# EAGLE design Scriptable Guitar Pedal (EAGLE 8.6.1)
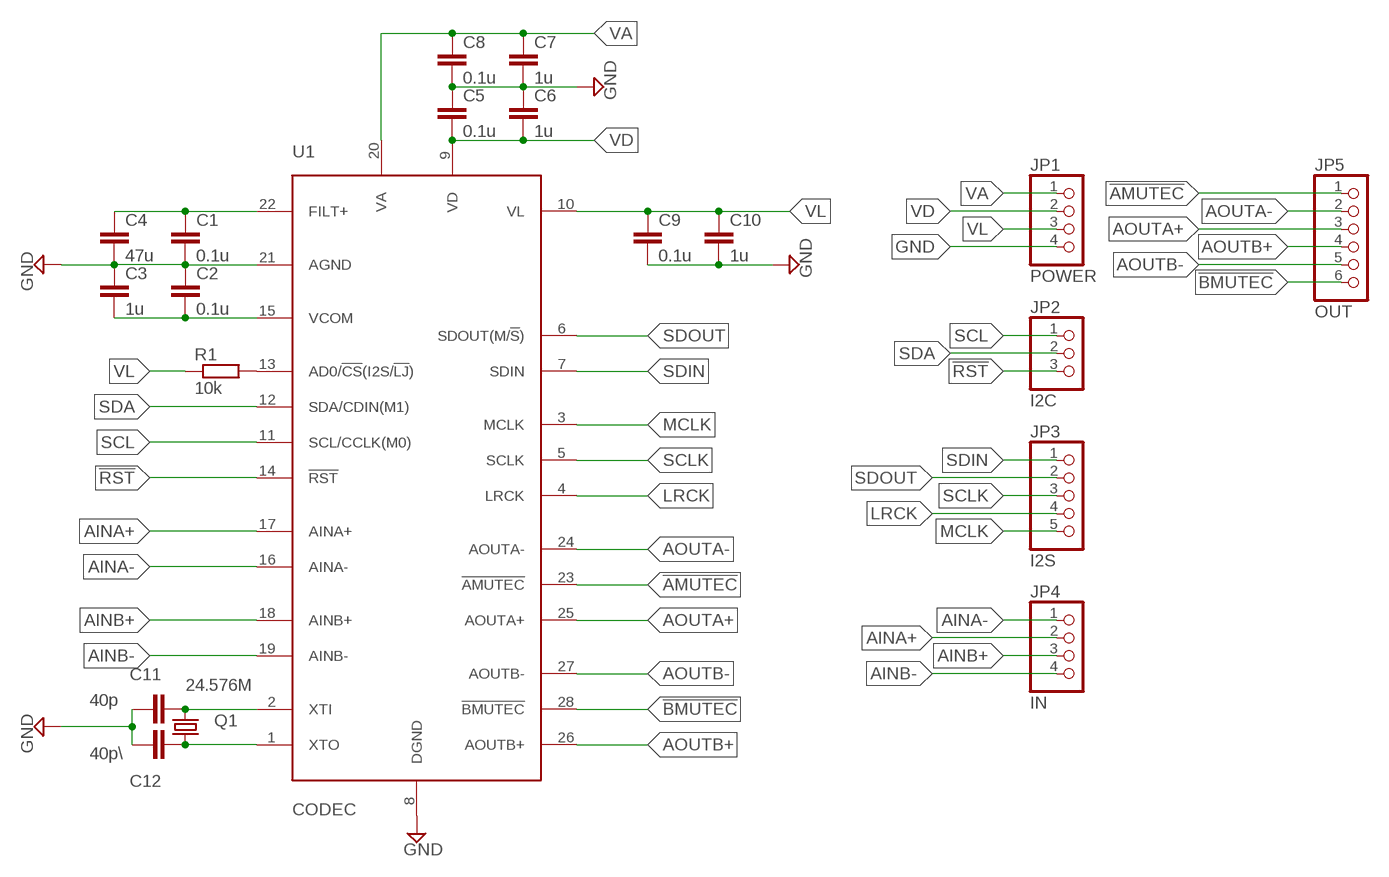
[diagram p0: schematic, sheet 1]

## Parts
C1  0.1u  C-EUC0603  [C0603]
C2  0.1u  C-EUC0603  [C0603]
C3  1u  C-EUC0603  [C0603]
C4  47u  C-EUC0603  [C0603]
C5  0.1u  C-EUC0603  [C0603]
C6  1u  C-EUC0603  [C0603]
C7  1u  C-EUC0603  [C0603]
C8  0.1u  C-EUC0603  [C0603]
C9  0.1u  C-EUC0603  [C0603]
C10  1u  C-EUC0603  [C0603]
C11  40p  C-EUC0603  [C0603]
C12  40p\  C-EUC0603  [C0603]
JP1  POWER  PINHD-1X4  [1X04]
JP2  I2C  PINHD-1X3  [1X03]
JP3  I2S  PINHD-1X5  [1X05]
JP4  IN  PINHD-1X4  [1X04]
JP5  OUT  PINHD-1X6  [1X06]
Q1  24.576M  CRYSTALHC49U-V  [HC49U-V]
R1  10k  R-EU_R0603  [R0603]
U1  CODEC  CS4272  [TSSOP-28]

## Nets
!AMUTEC!: JP5.1 U1.23(!AMUTEC!)
!BMUTEC!: JP5.6 U1.28(!BMUTEC!)
!RST!: JP2.3 U1.14(!RST!)
AINA+: JP4.2 U1.17(AINA+)
AINA-: JP4.1 U1.16(AINA-)
AINB+: JP4.3 U1.18(AINB+)
AINB-: JP4.4 U1.19(AINB-)
AOUTA+: JP5.3 U1.25(AOUTA+)
AOUTA-: JP5.2 U1.24(AOUTA-)
AOUTB+: JP5.4 U1.26(AOUTB+)
AOUTB-: JP5.5 U1.27(AOUTB-)
FILT+: C1.1 C4.1 U1.22(FILT+)
GND: C1.2 C2.1 C3.1 C4.2 C5.1 C6.1 C7.2 C8.2 C9.2 C10.2 C11.1 C12.1 JP1.4 U1.8(DGND) U1.21(AGND)
LRCK: JP3.4 U1.4(LRCK)
MCLK: JP3.5 U1.3(MCLK)
N$1: C12.2 Q1.1 U1.1(XTO)
N$2: C11.2 Q1.2 U1.2(XTI)
N$5: R1.2 U1.13(AD0/!CS!(I2S/!LJ!))
SCL: JP2.1 U1.11(SCL/CCLK(M0))
SCLK: JP3.3 U1.5(SCLK)
SDA: JP2.2 U1.12(SDA/CDIN(M1))
SDIN: JP3.1 U1.7(SDIN)
SDOUT: JP3.2 U1.6(SDOUT(M/!S!))
VA: C7.1 C8.1 JP1.1 U1.20(VA)
VCOM: C2.2 C3.2 U1.15(VCOM)
VD: C5.2 C6.2 JP1.2 U1.9(VD)
VL: C9.1 C10.1 JP1.3 R1.1 U1.10(VL)

## Library data of the parts
C1-C12 = rcl:C-EU: CAPACITOR, European symbol; SPICEPREFIX: C
JP1 JP4 = pinhead:PINHD-1X4: PIN HEADER
JP2 = pinhead:PINHD-1X3: PIN HEADER
JP3 = pinhead:PINHD-1X5: PIN HEADER
JP5 = pinhead:PINHD-1X6: PIN HEADER
Q1 = crystal:CRYSTAL: CRYSTAL; OC_FARNELL: 1666969; OC_NEWARK: unknown
R1 = rcl:R-EU_: RESISTOR, European symbol; SPICEPREFIX: R
U1 = CS4272:CS4272: 24-bit, 192 kHz Stereo Audio CODEC D/A Features High Performance 114 dB Dynamic Range -100 dB THD+N Up to 192 kHz Sampling Rates Differential Analog Architecture Volume Control with Soft Ramp 1 dB Step Size Zero Crossing Click-free Transitions Selectable Digital Filters Fast and Slow Roll Off ATAPI Mixing Functions Selectable Serial Audio Interface Formats Left Justified up to 24-bit I2S up to 24-bit Right Justified 16-, 18-, 20-, and 24-bit Control Output for External Muting Selectable 50/15 us De-emphasis A/D Features High Performance 114 dB Dynamic Range -100 dB THD+N Up to 192 kHz Sampling Rates Differential Analog Architecture Multi-bit Delta Sigma Conversion High-pass Filter or DC Offset Calibration Low-Latency Digital Anti-alias Filtering Automatic Dithering of 16-bit Data Selectable Serial Audio Interface Formats Left Justified up to 24-bit I2S up to 24-bit System Features Direct Interface with 5V to 2.5V Logic Levels Internal Digital Loopback On-chip Oscillator Stand-Alone or Control Port Functionality

## Board
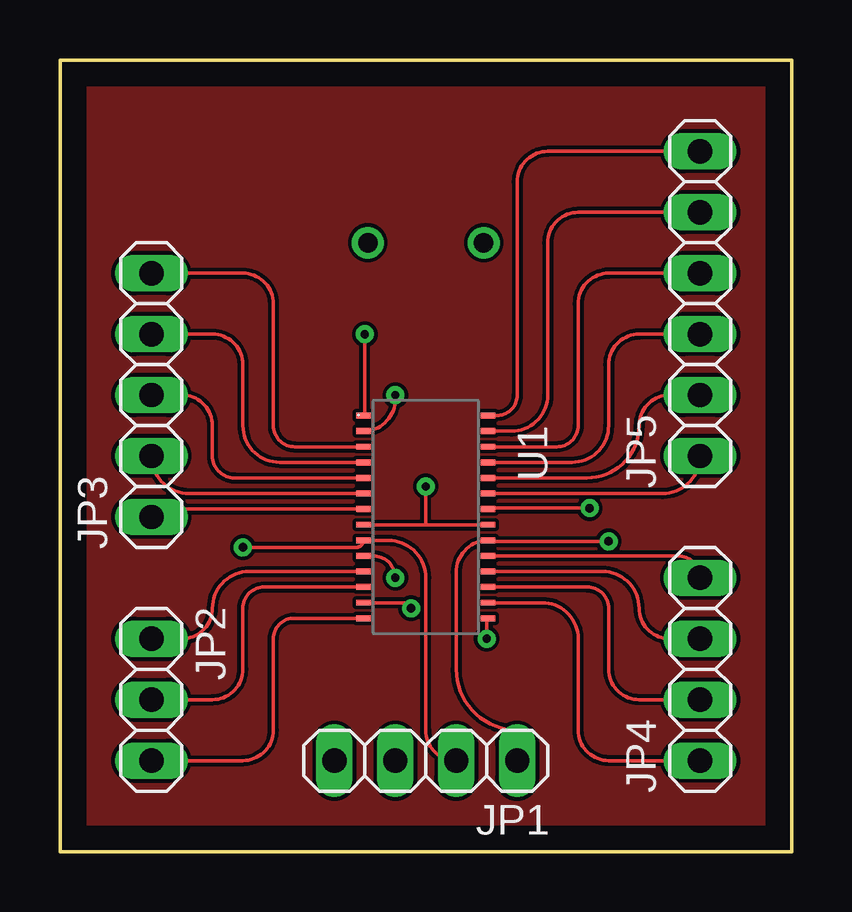
[diagram p1: board, top side]
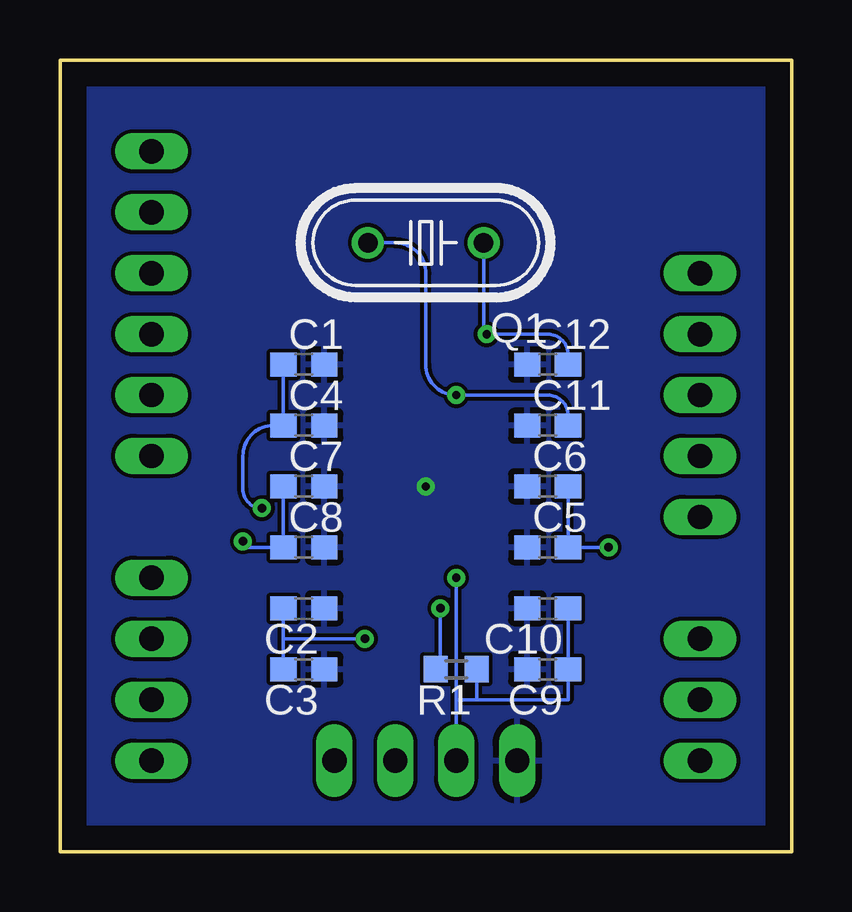
[diagram p2: board, bottom side, seen from below]

Size 30.48 x 33.02 mm. Coordinates in mm from the lower left corner, seen from the top.
Outline: 0,0 30.48,0 30.48,33.02 0,33.02 0,0
Copper layers (1*16): Top 0.035mm / dielectric 1.5mm / Bottom 0.035mm
Design rules "default": minimum track width 6mil, minimum drill 0.35mm, track to track 6mil, track to pad 6mil, pad to pad 6mil, via to via 6mil, smd to smd 6mil, copper to edge 40mil, drill to drill 6mil, minimum pad ring 10mil, minimum via ring 8mil, stop-mask expansion 4mil, vias tented up to drill 0mil, thermal gap 10mil

### Footprints (pad centres in the part's own frame; a part is rotated, then mirrored left to right if it is on the bottom)
C0603 = smd 1.1 x 1: 1 -0.85,0; 2 0.85,0
1X04 = drill 1.016 long: 1 -3.81,0; 2 -1.27,0; 3 1.27,0; 4 3.81,0
1X03 = drill 1.016 long: 1 -2.54,0; 2 0,0; 3 2.54,0
1X05 = drill 1.016 long: 1 -5.08,0; 2 -2.54,0; 3 0,0; 4 2.54,0; 5 5.08,0
1X06 = drill 1.016 long: 1 -6.35,0; 2 -3.81,0; 3 -1.27,0; 4 1.27,0; 5 3.81,0; 6 6.35,0
HC49U-V = drill 0.813: 1 -2.413,0; 2 2.413,0
R0603 = smd 1 x 1.1: 1 -0.85,0; 2 0.85,0
TSSOP-28 = smd 0.245 x 0.6: 1 -4.225,-2.6; 2 -3.575,-2.6; 3 -2.925,-2.6; 4 -2.275,-2.6; 5 -1.625,-2.6; 6 -0.975,-2.6; 7 -0.325,-2.6; 8 0.325,-2.6; 9 0.975,-2.6; 10 1.625,-2.6; 11 2.275,-2.6; 12 2.925,-2.6; 13 3.575,-2.6; 14 4.225,-2.6; 15 4.225,2.6; 16 3.575,2.6; 17 2.925,2.6; 18 2.275,2.6; 19 1.625,2.6; 20 0.975,2.6; 21 0.325,2.6; 22 -0.325,2.6; 23 -0.975,2.6; 24 -1.625,2.6; 25 -2.275,2.6; 26 -2.925,2.6; 27 -3.575,2.6; 28 -4.225,2.6

### Placement (x,y rotation side)
C1  20.32,20.32 0 bottom
C2  20.32,10.16 180 bottom
C3  20.32,7.62 180 bottom
C4  20.32,17.78 0 bottom
C5  10.16,12.7 0 bottom
C6  10.16,15.24 0 bottom
C7  20.32,15.24 0 bottom
C8  20.32,12.7 0 bottom
C9  10.16,7.62 180 bottom
C10  10.16,10.16 180 bottom
C11  10.16,17.78 0 bottom
C12  10.16,20.32 0 bottom
JP1  15.24,3.81 180 top
JP2  3.81,6.35 270 top
JP3  3.81,19.05 90 top
JP4  26.67,7.62 90 top
JP5  26.67,22.86 90 top
Q1  15.24,25.4 180 bottom
R1  13.97,7.62 180 bottom
U1  15.24,13.97 270 top

### Tracks (layer width: path | path; a pad name or v marks a point on that pad's centre or on a via)
!AMUTEC!
  Top 0.152: JP5.1 arc-90 25.11,14.95 U1.23
!BMUTEC!
  Top 0.152: JP5.6 20.32,29.21 arc90 19.05,27.94 19.05,19.05 arc-90 18.2,18.2 U1.28
!RST!
  Top 0.152: JP2.3 7.62,3.81 arc90 8.89,5.08 8.89,8.89 arc-90 9.74,9.74 U1.14
AINA+
  Top 0.152: JP4.2 24.13,6.35 arc-90 22.86,7.62 22.86,10.16 arc90 21.98,11.04 U1.17
AINA-
  Top 0.152: JP4.1 22.86,3.81 arc-90 21.59,5.08 21.59,8.89 arc90 20.09,10.39 U1.16
AINB+
  Top 0.152: JP4.3 25.4,8.89 arc-90 24.13,10.16 arc90 22.59,11.7 U1.18
AINB-
  Top 0.152: JP4.4 arc90 25.75,12.35 U1.19
AOUTA+
  Top 0.152: JP5.3 24.13,21.59 arc90 22.86,20.32 22.86,17.78 arc-90 21.32,16.25 U1.25
AOUTA-
  Top 0.152: JP5.2 25.4,19.05 arc90 24.13,17.78 arc-90 21.95,15.6 U1.24
AOUTB+
  Top 0.152: JP5.4 22.86,24.13 arc90 21.59,22.86 21.59,17.78 arc-90 20.7,16.89 U1.26
AOUTB-
  Top 0.152: JP5.5 21.59,26.67 arc90 20.32,25.4 20.32,19.05 arc-90 18.82,17.55 U1.27
FILT+  (via drill 0.35)
  Top 0.152: U1.22 arc-90 17.88,14.34 v22.07,14.34
  Bottom 0.152: C1.1 C4.1 21.59,17.78 arc-90 22.86,16.51 22.86,15.13 arc-90 v22.07,14.34
GND  (via drill 0.35)
  Top 0.152: U1.8 15.24,13.64 | 15.24,13.64 U1.21 | 15.24,13.64 v15.24,15.24
  pour Bottom: 0,0 30.48,0 30.48,33.02 0,33.02
LRCK
  Top 0.152: JP3.4 6.35,21.59 arc-90 7.62,20.32 7.62,17.78 arc90 9.15,16.25 U1.4
MCLK
  Top 0.152: JP3.5 7.62,24.13 arc-90 8.89,22.86 8.89,17.78 arc90 9.78,16.89 U1.3
N$1  (via drill 0.35)
  Top 0.152: U1.1 arc90 12.7,18.25 v12.7,21.59
  Bottom 0.152: C12.2 9.31,20.74 arc-90 10.16,21.59 v12.7,21.59 arc90 12.83,21.72 Q1.1
N$2  (via drill 0.35)
  Top 0.152: U1.2 arc90 13.97,18.88 v13.97,19.05
  Bottom 0.152: C11.2 9.31,18.2 arc-90 10.16,19.05 v13.97,19.05 arc90 15.24,20.32 15.24,24.13 arc-90 16.51,25.4 Q1.2
N$3
  pour Top: 0,0 30.48,0 30.48,33.02 0,33.02
N$5  (via drill 0.35)
  Top 0.152: v14.63,10.16 arc90 14.4,10.39 U1.13
  Bottom 0.152: R1.2 arc-90 14.63,7.81 v14.63,10.16
SCL
  Top 0.152: JP2.1 5.08,8.89 arc90 6.35,10.16 arc-90 7.88,11.7 U1.11
SCLK
  Top 0.152: JP3.3 5.08,19.05 arc-90 6.35,17.78 6.35,16.51 arc90 7.26,15.6 U1.5
SDA
  Top 0.152: JP2.2 6.35,6.35 arc90 7.62,7.62 7.62,10.16 arc-90 8.51,11.04 U1.12
SDIN
  Top 0.152: JP3.1 arc-90 4.13,14.29 U1.7
SDOUT
  Top 0.152: JP3.2 arc90 5.38,14.95 U1.6
VA  (via drill 0.35)
  Top 0.152: v22.86,12.95 17.88,12.95 arc-90 U1.20 arc90 16.51,11.66 16.51,7.62 arc90 19.05,5.08 JP1.1
  Bottom 0.152: C7.1 C8.1 22.61,12.7 arc90 v22.86,12.95
VCOM  (via drill 0.35)
  Top 0.152: U1.15 arc90 17.78,9.69 v17.78,8.89
  Bottom 0.152: C3.2 21.17,8.89 | 21.17,8.89 C2.2 | v17.78,8.89 21.17,8.89
VD  (via drill 0.35)
  Top 0.152: v7.62,12.7 12.35,12.7 arc90 U1.9 13.68,12.99 arc-90 15.24,11.43 15.24,5.08 arc90 JP1.2
  Bottom 0.152: C6.2 C5.2 v7.62,12.7
VL  (via drill 0.35)
  Top 0.152: v13.97,11.43 arc90 13.05,12.35 U1.10
  Bottom 0.152: C10.1 C9.1 9.31,6.35 13.12,6.35 | 13.12,6.35 R1.1 | JP1.3 13.97,6.35 | 13.97,6.35 v13.97,11.43 | 13.12,6.35 13.97,6.35